# EAGLE design untitled (EAGLE 7.3.2)
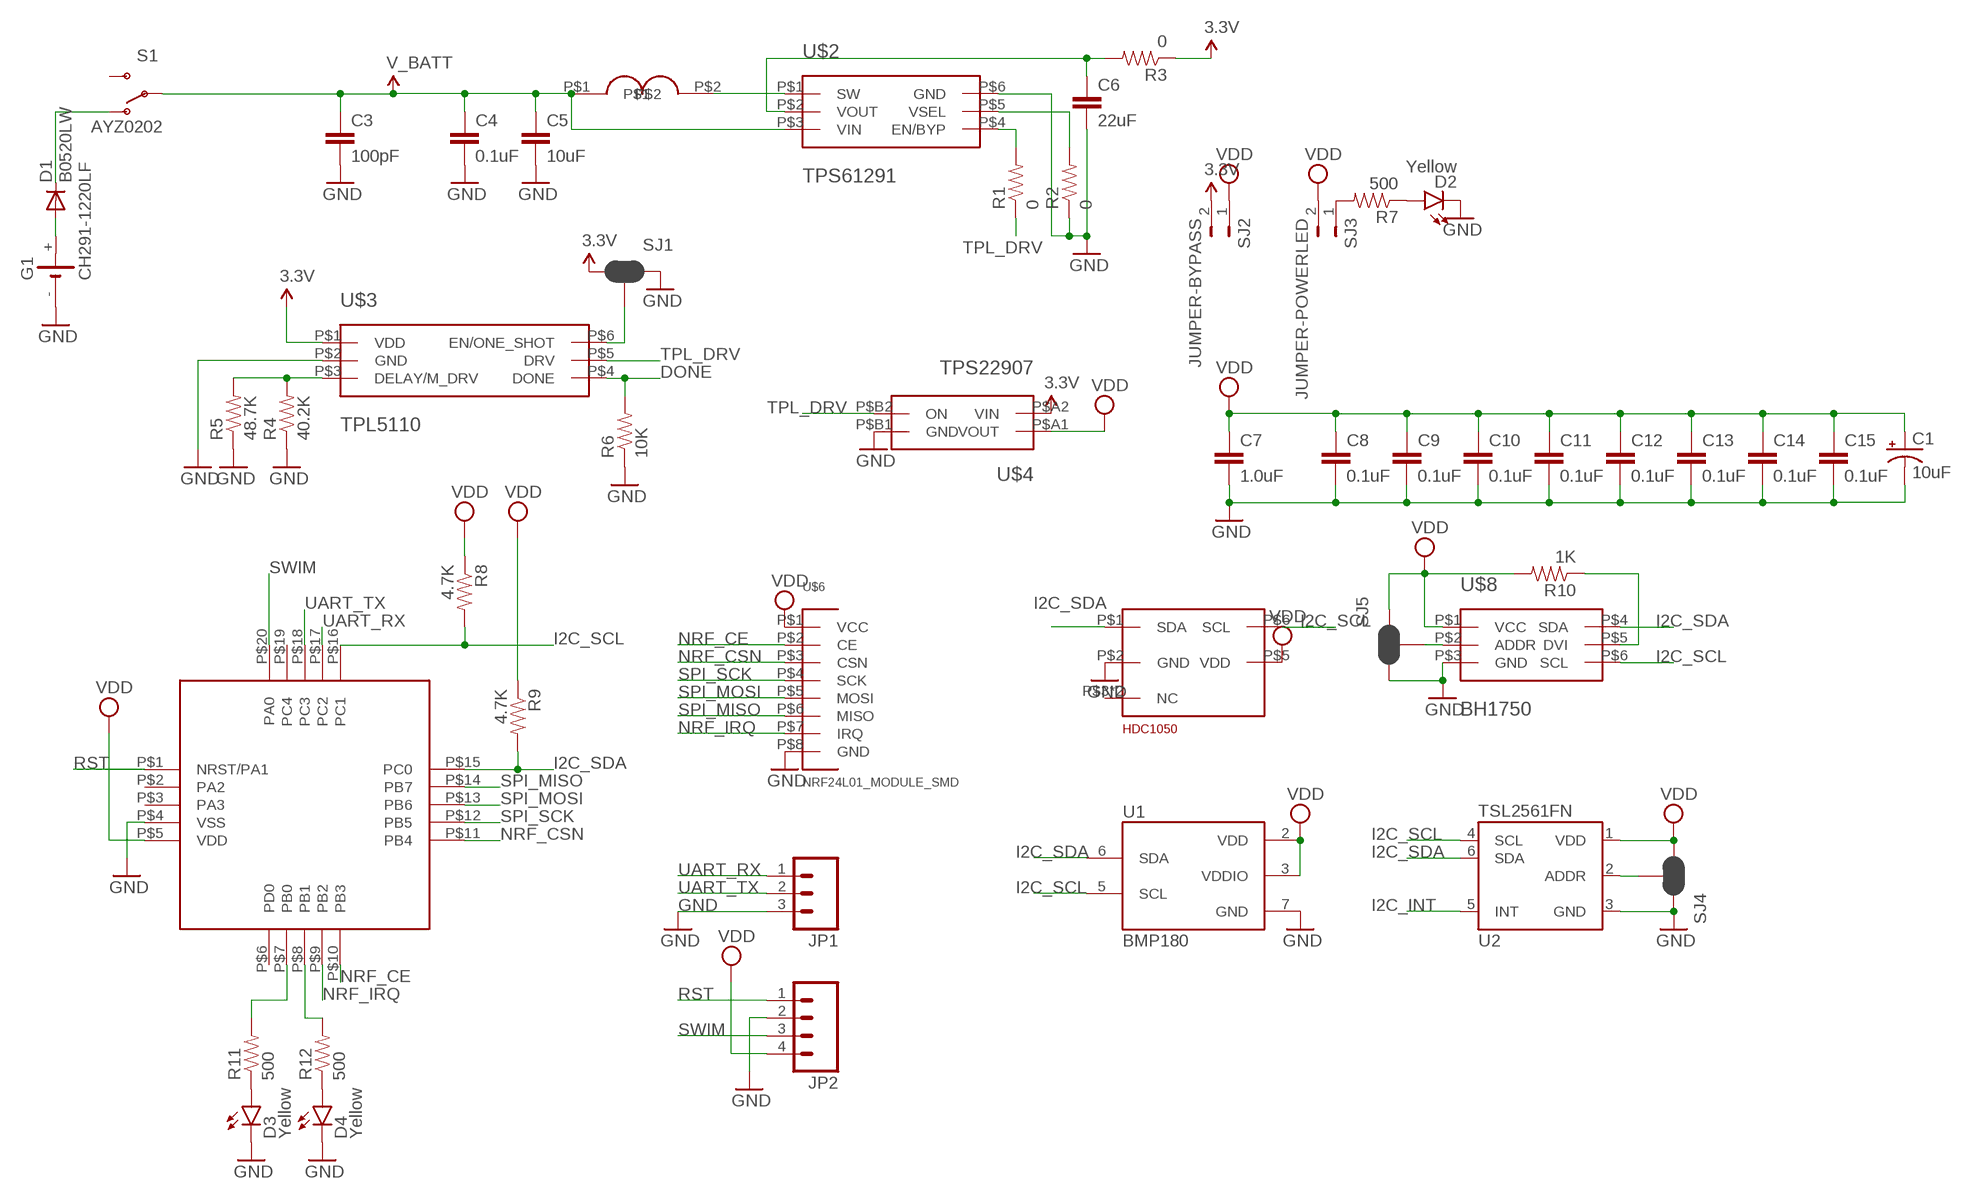
[diagram p0: schematic, sheet 1]

## Parts
C1  10uF  10UF-16V-10%(TANT)  [EIA3216]
C3  100pF  100PF-50V-5%(0603)  [0603-CAP]
C4  0.1uF  100PF-50V-5%(0603)  [0603-CAP]
C5  10uF  100PF-50V-5%(0603)  [0603-CAP]
C6  22uF  100PF-50V-5%(0603)  [0603-CAP]
C7  1.0uF  1.0UF-16V-10%(0603)  [0603-CAP]
C8  0.1uF  0.1UF-25V-5%(0603)  [0603-CAP]
C9  0.1uF  0.1UF-25V-5%(0603)  [0603-CAP]
C10  0.1uF  0.1UF-25V-5%(0603)  [0603-CAP]
C11  0.1uF  0.1UF-25V-5%(0603)  [0603-CAP]
C12  0.1uF  0.1UF-25V-5%(0603)  [0603-CAP]
C13  0.1uF  0.1UF-25V-5%(0603)  [0603-CAP]
C14  0.1uF  0.1UF-25V-5%(0603)  [0603-CAP]
C15  0.1uF  0.1UF-25V-5%(0603)  [0603-CAP]
D1  B0520LW  CGRM4001-G  [SOD-123_MINI-SMA]
D2  Yellow  LED-YELLOW0603  [LED-0603]
D3  Yellow  LED-YELLOW0603  [LED-0603]
D4  Yellow  LED-YELLOW0603  [LED-0603]
G1  CH291-1220LF  [CH291-1220LF]
JP1  M03LOCK  [1X03_LOCK]
JP2  M04LOCK  [1X04_LOCK]
R1  0  1.5KOHM-1/10W-1%(0603)  [0603]
R2  0  1.5KOHM-1/10W-1%(0603)  [0603]
R3  0  1.5KOHM-1/10W-1%(0603)  [0603]
R4  40.2K  0.22OHM-1/4W-1%(0805)  [0805]
R5  48.7K  0.22OHM-1/4W-1%(0805)  [0805]
R6  10K  1.5KOHM-1/10W-1%(0603)  [0603]
R7  500  1.5KOHM-1/10W-1%(0603)  [0603]
R8  4.7K  1.5KOHM-1/10W-1%(0603)  [0603]
R9  4.7K  1.5KOHM-1/10W-1%(0603)  [0603]
R10  1K  1.5KOHM-1/10W-1%(0603)  [0603]
R11  500  1.5KOHM-1/10W-1%(0603)  [0603]
R12  500  1.5KOHM-1/10W-1%(0603)  [0603]
S1  AYZ0202  SWITCH-SPDTSMD  [AYZ0202]
SJ1  JUMPER-PAD-3-NC_BY_PASTE  [PAD-JUMPER-3-NC_BY_PASTE_YES_SILK_FULL_BOX]
SJ2  JUMPER-BYPASS  JUMPER-PTH-2-NO  [PTH-JUMPER-2-NO_NO_SILK]
SJ3  JUMPER-POWERLED  JUMPER-PTH-2-NO  [PTH-JUMPER-2-NO_NO_SILK]
SJ4  JUMPER-PAD-3-NC_BY_PASTE  [PAD-JUMPER-3-NC_BY_PASTE_YES_SILK_FULL_BOX]
SJ5  JUMPER-PAD-3-NC_BY_PASTE  [PAD-JUMPER-3-NC_BY_PASTE_YES_SILK_FULL_BOX]
U1  BMP180  [BMP180]
U2  TSL2561FN  [FN-6]
U$1  SWPA4018S3R3MT  [SWPA4018S]
U$2  TPS61291  [PWSON-N6]
U$3  TPL5110  [DDC(R-PDSO-G6)]
U$4  TPS22907  [YZT(S-XBGA-N4)]
U$5  STM8L101  [UFQFPN20]
U$6  NRF24L01_MODULE_SMD  [M08-1.27]
U$7  HDC1050  [PWSON-N6]
U$8  BH1750  [WSOF-6]

## Nets
3.3V: R3.1 SJ1.1 SJ2.2 U$3.P$1(VDD) U$4.P$A2(VIN)
DONE: R6.2 U$3.P$4(DONE)
GND: C1.C(-) C3.2 C4.2 C5.2 C6.2 C7.2 C8.2 C9.2 C10.2 C11.2 C12.2 C13.2 C14.2 C15.2 D2.C D3.C D4.C G1.- JP1.3 JP2.2 R2.1 R4.1 R5.1 R6.1 SJ1.3 SJ4.3 SJ5.1 U1.7(GND) U2.3(GND) U$2.P$6(GND) U$3.P$2(GND) U$4.P$B1(GND) U$5.P$4(VSS) U$6.P$8(GND) U$7.P$2(GND) U$8.P$3(GND)
I2C_INT: U2.5(INT)
I2C_SCL: R8.2 U1.5(SCL) U2.4(SCL) U$5.P$16(PC1) U$7.P$6(SCL) U$8.P$6(SCL)
I2C_SDA: R9.2 U1.6(SDA) U2.6(SDA) U$5.P$15(PC0) U$7.P$1(SDA) U$8.P$4(SDA)
MESH: C1.A(+) C7.1 C8.1 C9.1 C10.1 C11.1 C12.1 C13.1 C14.1 C15.1 JP2.4 R8.1 R9.1 R10.2 SJ2.1 SJ3.2 SJ4.1 SJ5.3 U1.2(VDD) U1.3(VDDIO) U2.1(VDD) U$4.P$A1(VOUT) U$5.P$5(VDD) U$6.P$1(VCC) U$7.P$5(VDD) U$8.P$1(VCC) ; supply symbol labelled VDD
N$1: D1.A G1.+
N$2: D1.C S1.1(O)
N$3: U$1.P$2 U$2.P$1(SW)
N$4: C6.1 R3.2 U$2.P$2(VOUT)
N$5: R1.2 U$2.P$4(EN/BYP)
N$6: R2.2 U$2.P$5(VSEL)
N$7: R4.2 R5.2 U$3.P$3(DELAY/M_DRV)
N$8: R7.2 SJ3.1
N$9: D2.A R7.1
N$10: SJ1.2 U$3.P$6(EN/ONE_SHOT)
N$11: SJ4.2 U2.2(ADDR)
N$12: SJ5.2 U$8.P$2(ADDR)
N$13: R10.1 U$8.P$5(DVI)
N$14: D3.A R11.1
N$15: D4.A R12.1
N$16: R11.2 U$5.P$7(PB0)
N$17: R12.2 U$5.P$8(PB1)
NRF_CE: U$5.P$10(PB3) U$6.P$2(CE)
NRF_CSN: U$5.P$11(PB4) U$6.P$3(CSN)
NRF_IRQ: U$5.P$9(PB2) U$6.P$7(IRQ)
RST: JP2.1 U$5.P$1(NRST/PA1)
SPI_MISO: U$5.P$14(PB7) U$6.P$6(MISO)
SPI_MOSI: U$5.P$13(PB6) U$6.P$5(MOSI)
SPI_SCK: U$5.P$12(PB5) U$6.P$4(SCK)
SWIM: JP2.3 U$5.P$20(PA0)
TPL_DRV: R1.1 U$3.P$5(DRV) U$4.P$B2(ON)
UART_RX: JP1.1 U$5.P$17(PC2)
UART_TX: JP1.2 U$5.P$18(PC3)
V_BATT: C3.1 C4.1 C5.1 S1.2(P) U$1.P$1 U$2.P$3(VIN)
Unconnected: S1.3(S) U$5.P$2(PA2) U$5.P$3(PA3) U$5.P$6(PD0) U$5.P$19(PC4) U$7.P$3(NC) U$7.P$4(NC)

## Library data of the parts
C1 = SparkFun-Capacitors:10UF-16V-10%(TANT): CAP-00811 1206/EIA-3216 Tantalum capacitor; PROD_ID: CAP-00811
C3 = SparkFun-Capacitors:100PF-50V-5%(0603): CAP-07883; PROD_ID: CAP-07883
C4-C6 = SparkFun-Capacitors:100PF-50V-5%(0603): CAP-07883; PROD_ID: CAP-07883; VALUE: 100pF
C7 = SparkFun-Capacitors:1.0UF-16V-10%(0603): CAP-00868; PROD_ID: CAP-00868
C8-C15 = SparkFun-Capacitors:0.1UF-25V-5%(0603): CAP-08604; PROD_ID: CAP-08604
D1 = diode:CGRM400*-G: Molded plasitc,JEDEC SOD-123/Mini SMA Source: Comchip CGRM4001-G.pdf
D2-D4 = SparkFun-LED:LED-YELLOW: Yellow SMD LEDs LilyPad 1206- DIO-09909 0603- DIO-09003 "SMART" means more efficient and expensive; PROD_ID: DIO-09003
G1 = battery:CH291-1220LF: Battery Holder, SMT, 12mm multicomp PART NO. CH291-1220LF Source: Data sheet <http://www.farnell.com/datasheets/1505860.pdf>
JP1 = SparkFun-Connectors:M03: Header 3 Standard 3-pin 0.1" header. Use with straight break away headers (SKU : PRT-00116), right angle break away headers (PRT-00553), swiss pins (PRT-00743), machine pins (PRT-00117), and female headers (PRT-00115). Molex polarized connector foot print use with SKU : PRT-08232 with associated crimp pins and housings.
JP2 = SparkFun-Connectors:M04: Header 4 Standard 4-pin 0.1" header. Use with straight break away headers (SKU : PRT-00116), right angle break away headers (PRT-00553), swiss pins (PRT-00743), machine pins (PRT-00117), and female headers (PRT-00115). Molex polarized connector foot print use with SKU : PRT-08231 with associated crimp pins and housings. 1MM SMD Version SKU: PRT-10208
R1-R3 R6-R12 = SparkFun-Resistors:1.5KOHM-1/10W-1%(0603): RES-08306; PROD_ID: RES-08306; VALUE: 1.5KOHM
R4 R5 = SparkFun-Resistors:0.22OHM-1/4W-1%(0805): RES-09883; PROD_ID: RES-09883; VALUE: 0.22
S1 = SparkFun-Electromechanical:SWITCH-SPDT: SPDT Switch Simple slide switch, Spark Fun Electronics SKU : COM-00102 DPDT SMT slide switch, AYZ0202, SWCH-08179; PROD_ID: SWCH-08179; SF_ID: COM-00597
SJ1 SJ4 SJ5 = SparkFun-Passives:JUMPER-PAD-3-NC_BY_PASTE
SJ2 SJ3 = SparkFun-Passives:JUMPER-PTH-2-NO
U1 = SparkFun-Sensors:BMP180: BOSCH BMP180 DIGITAL BAROMETRIC PRESSURE SENSOR Web page: http://www.bosch-sensortec.com/en/homepage/products_3/environmental_sensors_1/bmp180_1/bmp180 Datasheet: http://ae-bst.resource.bosch.com/media/products/dokumente/bmp180/BST-BMP180-DS000-09.pdf The BMP180 is the function compatible successor of the BMP085, a new generation of high precision digital pressure sensors for consumer applications. The ultra-low power, low voltage electronics of the BMP180 is optimized for use in mobile phones, PDAs, GPS navigation devices and outdoor equipment. With a low altitude noise of merely 0.25m at fast conversion time, the BMP180 offers superior performance. The I2C interface allows for easy system integration with a microcontroller. The BMP180 is based on piezo-resistive technology for EMC robustness, high accuracy and linearity as well as long term stability. Key features: - Temperature measurement included - I2C interface - Fully calibrated - Pb-free, halogen-free and RoHS compliant, - MSL 1 Basic specs: Pressure range: 300 to 1100hPa (+9000m to -500m relating to sea level) Supply voltage: 1.8 to 3.6V (VDD), 1.62V to 3.6V (VDDIO) Package: LGA package with metal lid Small footprint: 3.6mm x 3.8mm Super-flat: 0.93mm height Low power: 5μA at 1 sample / sec. in standard mode Low noise: 0.06hPa (0.5m) in ultra low power mode, 0.02hPa (0.17m) advanced resolution mode Typical applications: - Enhancement of GPS navigation (dead-reckoning, slope detection, etc.) - In- and out-door navigation - Leisure and sports - Weather forecast - Vertical velocity indication (rise/sink speed)
U2 = SparkFun-Sensors:TSL2561: TSL2561 illumination sensor Approximates Human Eye Response Precisely Measures Illuminance Programmable Interrupt Function with User-Defined Upper and Lower Threshold 400 KHz I2C interface Programmable Analog Gain and Integration Time Supporting 1,000,000-to-1 Dynamic Range Automatically Rejects 50/60-Hz Lighting Ripple Low Active Power (0.75 mW Typical) with Power Down Mode RoHS Compliant The TSL2561 is a light-to-digital converter that transform light intensity to a digital signal output via I2C interface. The device combines one broadband photodiode (visible plus infrared) and one infrared-responding photodiode on a single CMOS integrated circuit capable of providing a near-photopic response over an effective 20-bit dynamic range (16-bit resolution). Two integrating ADCs convert the photodiode currents to a digital output that represents the irradiance measured on each channel. This digital output can be input to a microprocessor where illuminance (ambient light level) in lux is derived using an empirical formula to approximate the human eye response. The TSL2561 device supports a traditional level style interrupt that remains asserted until the firmware clears it.
U$1 = User-Submitted:SWPA4018S3R3MT
U$2 = User-Submitted:TPS61291
U$3 = User-Submitted:TPL5110
U$4 = User-Submitted:TPS22907
U$5 = st-microelectronics:STM8L101; DEVICE: STM8F101
U$6 = User-Submitted:NRF24L01_MODULE_SMD
U$7 = User-Submitted:HDC1050
U$8 = User-Submitted:BH1750

## Board
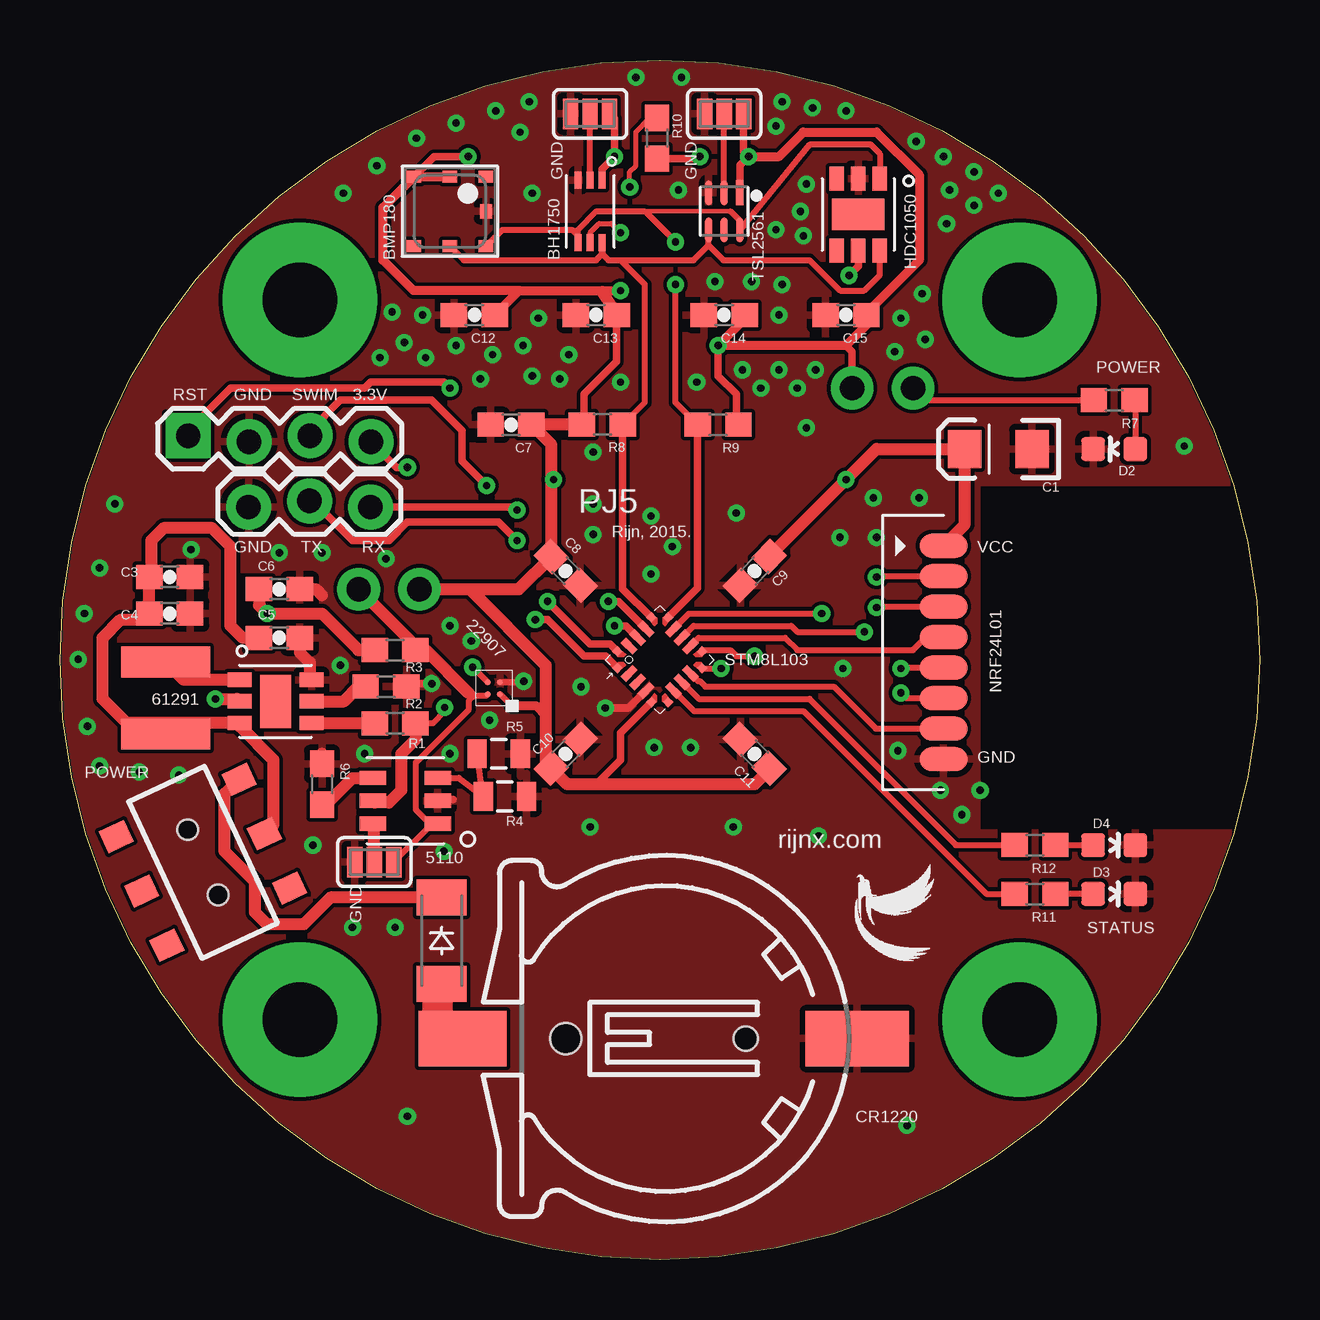
[diagram p1: board, top side]
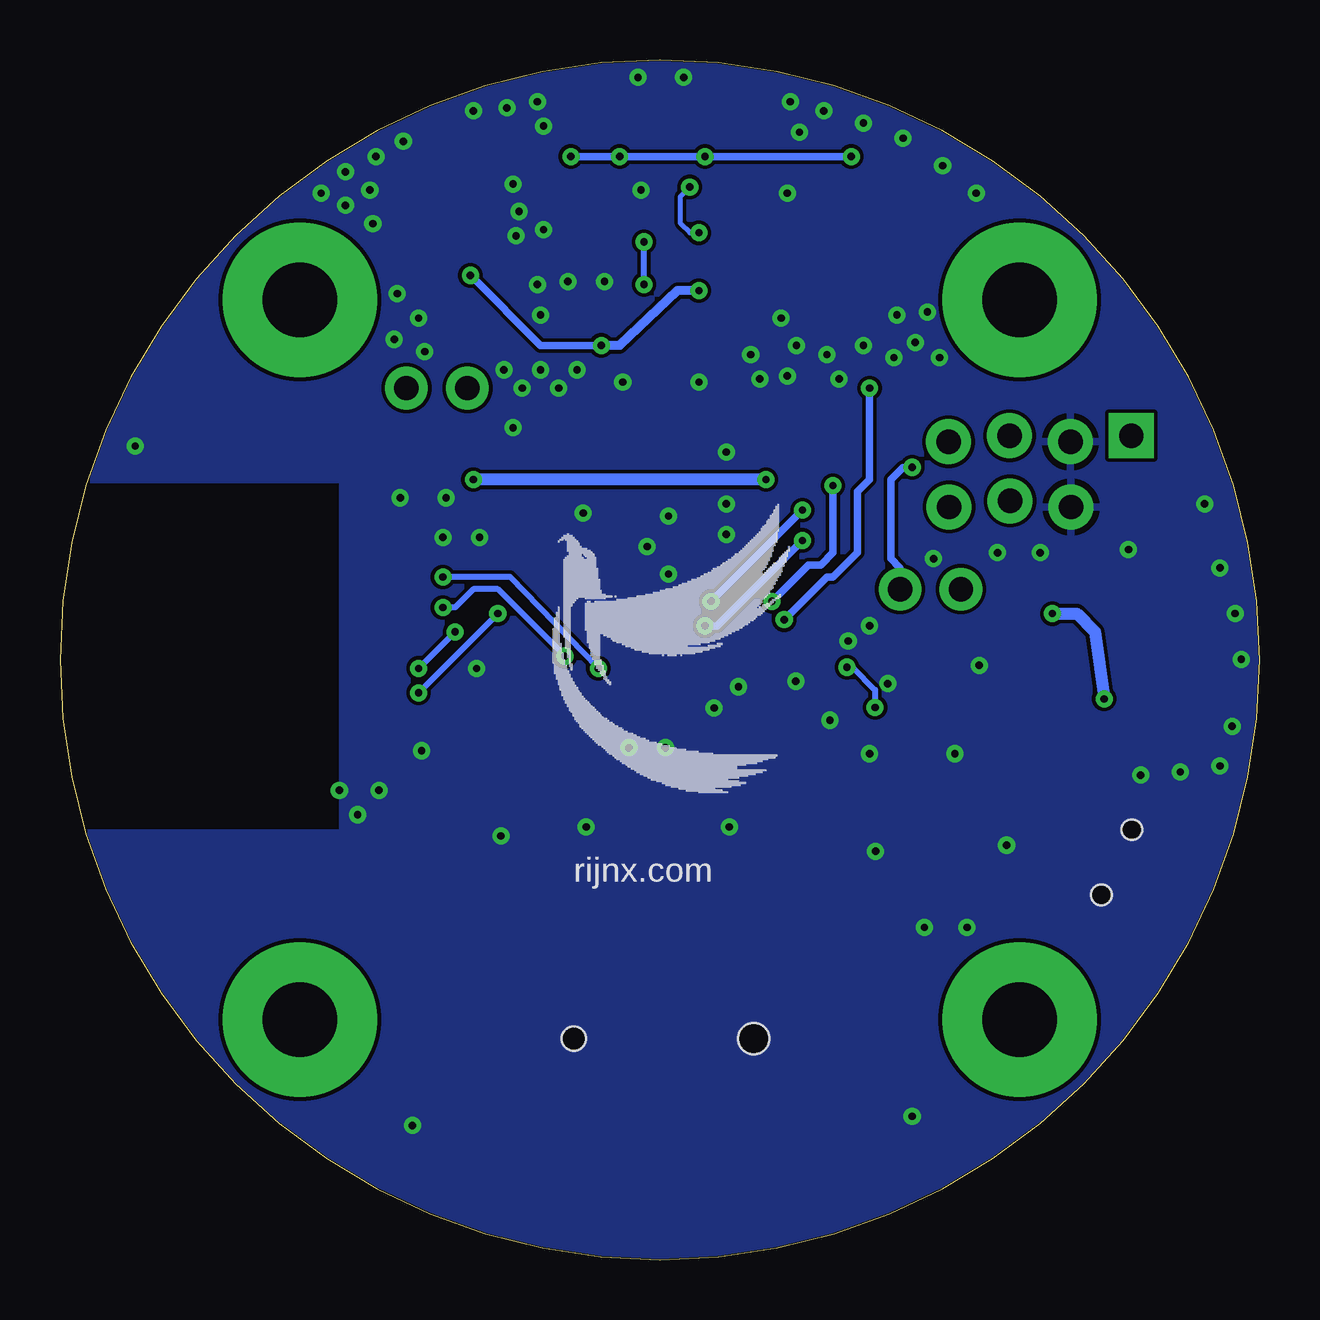
[diagram p2: board, bottom side, seen from below]

Size 50 x 50 mm. Coordinates in mm from the lower left corner, seen from the top.
Outline: 25,50 arc-180 25,0 arc-180 25,50
Copper layers (1*16): Top 0.035mm / dielectric 1.5mm / Bottom 0.035mm
Design rules "default *": minimum track width 6mil, minimum drill 12mil, track to track 6mil, track to pad 6mil, pad to pad 6mil, via to via 6mil, smd to smd 6mil, copper to edge 2mil, drill to drill 6mil, minimum pad ring 10mil, minimum via ring 8mil, stop-mask expansion 4mil, vias tented up to drill 15mil, thermal gap 10mil

### Footprints (pad centres in the part's own frame; a part is rotated, then mirrored left to right if it is on the bottom)
EIA3216 = smd 1.4 x 1.6: A 1.4,0; C -1.4,0
0603-CAP = smd 1.1 x 1: 1 -0.85,0; 2 0.85,0
SOD-123_MINI-SMA = smd 1.5 x 2.1: A 1.8,0; C -1.8,0
LED-0603 = smd 1 x 1: A 0,-0.877; C 0,0.877
CH291-1220LF = smd 2.3 x 3.66: + 0,-2.296 | smd 2.3 x 4.3: - 0,14.146 | hole 1.3: 0,2 | hole 1: 0,9.5
1X03_LOCK = drill 1.016 pad 1.88: 1 0,0.127; 2 2.54,-0.127; 3 5.08,0.127
1X04_LOCK = drill 1.016 pad 1.88 square: 1 0,0.127 | drill 1.016 pad 1.88: 2 2.54,-0.127; 3 5.08,0.127; 4 7.62,-0.127
0603 = smd 1.1 x 1: 1 -0.85,0; 2 0.85,0
0805 = smd 0.8 x 1.2: 1 -0.9,0; 2 0.9,0
AYZ0202 = smd 1 x 1.15: 1 -2.5,2.825; 2 0,2.825; 3 2.5,2.825; 4 -2.5,-2.825; 5 0,-2.825; 6 2.5,-2.825 | hole 0.85: 1.5,0; -1.5,0
PAD-JUMPER-3-NC_BY_PASTE_YES_SILK_FULL_BOX = smd 0.635 x 1.27: 1 -0.813,0; 2 0,0; 3 0.813,0
PTH-JUMPER-2-NO_NO_SILK = drill 1.016 pad 1.778: 1 -1.27,0; 2 1.27,0
BMP180 = smd 0.6 x 0.5: 1 1.5,1.45; 2 0,1.45; 3 -1.5,1.45; 4 -1.5,-1.45; 5 0,-1.45; 6 1.5,-1.45 | smd 0.5 x 0.6: 7 1.5,0
FN-6 = smd 1.05 x 0.3: 1 -0.775,0.65; 2 -0.775,0; 3 -0.775,-0.65; 4 0.775,-0.65; 5 0.775,0; 6 0.775,0.65
SWPA4018S = smd 1.3 x 3.7: P$1 -1.5,0; P$2 1.5,0
PWSON-N6 = smd 0.6 x 1: P$1 0.9,1.5; P$2 0,1.5; P$3 -0.9,1.5; P$4 -0.9,-1.5; P$5 0,-1.5; P$6 0.9,-1.5 | smd 2.2 x 1.3: P$7 0,0
DDC(R-PDSO-G6) = smd 0.6 x 1.1: P$1 -0.95,-1.35; P$2 0,-1.35; P$3 0.95,-1.35; P$4 0.95,1.35; P$5 0,1.35; P$6 -0.95,1.35
YZT(S-XBGA-N4) = smd 0.25 x 0.25: P$A1 0.25,-0.25; P$A2 -0.25,-0.25; P$B1 0.25,0.25; P$B2 -0.25,0.25
UFQFPN20 = smd 0.3 x 0.3: P$1 -1.5,1; P$5 -1.5,-1; P$6 -1,-1.5; P$10 1,-1.5; P$11 1.5,-1; P$15 1.5,1; P$16 1,1.5; P$20 -1,1.5 | smd 0.7 x 0.3: P$2 -1.3,0.5; P$3 -1.3,0; P$4 -1.3,-0.5; P$12 1.3,-0.5; P$13 1.3,0; P$14 1.3,0.5 | smd 0.3 x 0.7: P$7 -0.5,-1.3; P$8 0,-1.3; P$9 0.5,-1.3; P$17 0.5,1.3; P$18 0,1.3; P$19 -0.5,1.3
M08-1.27 = smd 1 x 2: P$1 0,0; P$2 1.27,0; P$3 2.54,0; P$4 3.81,0; P$5 5.08,0; P$6 6.35,0; P$7 7.62,0; P$8 8.89,0
WSOF-6 = smd 0.3 x 0.7: P$1 -0.5,-1.3; P$2 0,-1.3; P$3 0.5,-1.3; P$4 0.5,1.3; P$5 0,1.3; P$6 -0.5,1.3

### Placement (x,y rotation side)
C1  39.12,33.78 180 top
C3  4.57,28.45 0 top
C4  4.57,26.92 0 top
C5  9.14,25.91 0 top
C6  9.14,27.94 0 top
C7  18.8,34.8 180 top
C8  21.08,28.7 315 top
C9  28.96,28.7 225 top
C10  21.08,21.08 45 top
C11  28.96,21.08 135 top
C12  17.27,39.37 180 top
C13  22.35,39.37 180 top
C14  27.69,39.37 180 top
C15  32.77,39.37 180 top
D1  15.91,13.29 270 top
D2  43.94,33.78 90 top
D3  43.94,15.24 270 top
D4  43.94,17.27 270 top
G1  19.08,9.21 270 top
JP1  12.94,31.49 180 top
JP2  5.34,34.21 0 top
R1  13.97,22.35 180 top
R2  13.59,23.88 180 top
R3  13.97,25.4 180 top
R4  18.54,19.3 180 top
R5  18.29,21.08 180 top
R6  10.92,19.81 270 top
R7  43.94,35.81 180 top
R8  22.61,34.8 0 top
R9  27.43,34.8 180 top
R10  24.89,46.74 270 top
R11  40.64,15.24 180 top
R12  40.64,17.27 180 top
S1  5.96,16.56 295 top
SJ1  13.1,16.57 180 top
SJ2  13.72,27.94 180 top
SJ3  34.29,36.32 180 top
SJ4  27.69,47.75 180 top
SJ5  22.1,47.75 0 top
U1  16.26,43.69 0 top
U2  27.69,43.69 270 top
U$1  4.41,23.41 90 top
U$2  8.98,23.27 90 top
U$3  14.4,19.12 90 top
U$4  18.09,23.81 0 top
U$5  25,25 45 top
U$6  36.83,29.75 270 top
U$7  33.27,43.56 0 top
U$8  22.1,43.69 180 top
U$9  [LOGO-3]  29.51,19.41 0 bottom
U$10  [LOGO-1]  33.12,12.43 0 top

### Tracks (layer width: path | path; a pad name or v marks a point on that pad's centre or on a via)
3.3V
  Top 0.254: 17.02,23.62 17.17,23.62 17.27,23.52 | 17.27,23.52 17.8,23.52 U$4.P$A2 | U$3.P$1 15.4,18.17 | 15.4,18.17 14.83,18.75 14.83,20.73 17.04,22.94 17.04,23.29 17.27,23.52 | 15.4,18.17 15.4,18.06 SJ1.1
  Top 0.508: SJ2.2 14.82,25.57 R3.1 15.24,25.4 17.02,23.62
DONE
  Top 0.508: R6.2 11.09,18.96 12.19,20.07 U$3.P$4
GND  (via drill 0.3)
  Top 0.254: U$4.P$B1 19.29,24.06 v19.33,24.11
  Top 0.305: R2.1 14.95,24 v15.49,24 | U$3.P$2 15.8,19.18 16.38,19.18 | U$5.P$4 23.69,22.99 v22.73,22.99
  Top 0.508: C5.2 9.99,25.31 10.41,24.89 10.41,24.24 U$2.P$6 | C6.2 10.67,27.94 10.92,27.69 | R6.1 10.92,21.08
  other vias: 11.68,24.77 21.21,37.72 19.68,36.83 18.03,37.72 14.35,38.23 11.81,44.45 19.68,44.45 30.1,48.26 30.1,40.64 25.78,44.58 16.26,26.42 17.14,25.78 22.23,31.5 22.23,30.23 22.23,33.66 2.29,31.5 5.46,29.59 17.91,22.48 21.72,23.88 24.77,21.34 26.29,21.34 31.62,17.65 14.48,5.97 35.31,5.59 28.19,31.11 24.64,30.99 25.53,29.72 24.64,28.57 22.1,18.03 28.07,18.03 32.51,30.1 32.64,24.64 34.92,21.21 34.04,30.1 33.91,31.75 35.81,31.75 46.86,33.91 36.7,19.56 38.35,19.56 37.59,18.54 1.65,28.83 1.02,26.92 0.76,25.02 1.14,22.23 1.65,20.57 3.3,20.32 4.95,20.19 10.54,17.27 9.14,29.46 10.92,29.46 13.59,29.21 12.19,13.84 13.97,13.84 16,17.02 16.26,21.08 31.11,34.67 13.21,45.59 14.86,46.74 16.51,47.37 18.16,47.88 19.56,48.26 19.18,46.99 24,49.28 25.91,49.28 31.37,48.01 32.77,47.88 29.84,47.24 35.69,46.61 36.83,45.97 38.1,45.34 39.12,44.45 37.08,44.58 38.1,43.94 36.96,43.18 35.94,40.26 35.05,39.24 36.07,38.35 34.8,37.85 13.84,39.5 15.11,39.37 13.34,37.59 15.24,37.59 16.51,38.1 17.53,36.7 19.94,39.24 19.3,38.1 20.83,36.7 23.37,36.58 26.54,36.58 28.45,37.08 29.21,36.32 29.97,37.08 30.73,36.32 31.5,37.08 30.86,43.69 29.84,42.93 30.99,42.67 27.3,40.77 28.83,40.77 29.97,39.37 12.7,21.08 31.11,44.83
  pour Top: -1.27,51.31 50.8,51.31 50.8,32.38 38.23,32.38 38.23,17.78 50.93,17.78 50.93,-0.64 -1.27,-0.64
  pour Bottom: 0.13,53.72 53.09,53.72 53.09,32.51 38.23,32.51 38.23,17.78 50.93,17.78 50.93,-0.51 -0.38,-0.51 -0.38,53.72
I2C_SCL
  Top 0.254: U1.5 16.84,41.66 22.35,41.66 22.6,41.9 U$8.P$6 22.61,41.91 22.86,41.66 23.37,41.66 | 23.37,41.66 26.42,41.66 27.04,42.28 | 27.04,42.28 U2.4 | 27.04,42.28 27.66,41.66 31.24,41.66 32.51,40.39 33.53,40.39 34.17,41.03 U$7.P$6 | R8.2 24.38,35.73 24.38,40.64 23.37,41.66
  Top 0.305: U$5.P$16 23.46,27.96 R8.2
I2C_SDA  (via drill 0.3)
  Top 0.178: 27.94,43.69 23.75,43.69
  Top 0.254: U1.6 18.44,42.93 21.34,42.93 21.59,42.67 | 21.59,42.67 21.6,42.66 U$8.P$4 21.59,42.67 | 21.59,42.67 21.59,42.93 22.35,43.69 23.75,43.69 24.38,43.69 v25.65,42.42 | 27.94,43.69 28.34,43.29 U2.6 31.27,46.48 33.78,46.48 34.17,46.09 U$7.P$1 | R9.2 25.65,35.73 v25.65,40.64
  Top 0.305: U$5.P$15 26.58,28 R9.2
  Bottom 0.254: v25.65,40.64 v25.65,42.42
MESH  (via drill 0.3)
  Top 0.178: v20.57,32.51 20.48,32.6 20.48,33.53
  Top 0.254: U$4.P$A1 18.82,23.09
  Top 0.305: U$8.P$1 22.6,45.46 v23.11,45.97 23.11,47.55 SJ5.3 | v17.02,45.97 15.59,45.97 U1.3 | U2.1 28.34,45.61 v28.7,45.97 28.5,46.18 SJ4.1 | U$7.P$5 33.27,41.4 v32.89,41.02 | R10.2 26.58,45.89 v26.67,45.97 | C13.1 23.2,37.43 21.84,36.07 21.84,34.89 R8.1 | v27.43,38.1 27.43,36.83 28.19,36.07 28.19,34.89 R9.1 | SJ3.2 33.02,37.85 32.77,38.1 | U$5.P$5 23.37,21.95 23.37,20.83 22.35,19.81 | JP2.4 14.03,33.02 v14.48,33.02
  Top 0.381: 18.82,23.09 19.84,23.09 20.24,22.68 | C12.1 19.14,40.39 | 19.14,40.39 22.61,40.39 | 22.61,40.39 23.2,39.54 C13.1 22.61,40.22 22.61,40.39 | 22.61,40.39 v23.37,40.39 | C14.1 28.54,39.2 v27.43,38.1 32.77,38.1 33.62,38.95 C15.1 | 19.14,40.39 14.73,40.39 13.46,41.66 13.46,43.84 U1.3 U1.2 | v28.7,45.97 29.97,45.97 30.99,46.99 34.04,46.99 35.81,45.21 35.81,41.66 33.53,39.37
  Top 0.508: C9.1 v32.77,32.51 34.04,33.78 C1.A 37.72,30.64 U$6.P$1 | R8.1 C7.1 20.48,33.96 20.48,33.53 C8.1 19.12,27.94 SJ2.1 17.07,27.94 20.24,24.77 20.24,22.68 20.24,20.72 C10.1 21.15,19.81 22.35,19.81 28.96,19.81 29.56,20.41 C11.1
  Bottom 0.305: v17.02,45.97 v23.11,45.97 v26.67,45.97 v28.7,45.97 | v32.89,41.02 29.97,38.1 v27.43,38.1 | v14.48,33.02 14.86,33.02 15.37,32.51 15.37,29.21 14.99,28.83 SJ2.1
  Bottom 0.381: v23.37,40.39 24.26,40.39 26.67,38.1 v27.43,38.1
  Bottom 0.508: v20.57,32.51 v32.77,32.51
N$1
  Top 1.27: D1.A 15.75,11.49 15.75,9.65 16.79,9.65 G1.+
N$2
  Top 0.508: D1.C 11.28,15.09 10.16,13.97 8.64,13.97 8.13,14.48 8.13,15.75 6.86,17.02 6.86,19.41 S1.1
N$3
  Top 0.508: U$2.P$1 5.16,24.17 U$1.P$2
N$4  (via drill 0.3)
  Top 0.508: C6.1 8.29,27.27 v8.64,26.92 10.92,26.92 12.45,25.4 R3.2 | v6.48,23.37 7.38,23.37 U$2.P$2
  Bottom 0.508: v8.64,26.92 7.62,26.92 6.86,26.16 v6.48,23.37
N$5
  Top 0.508: U$2.P$4 13.11,22.37 R1.2
N$6
  Top 0.508: U$2.P$5 11.84,23.27 12.45,23.88 R2.2
N$7
  Top 0.254: U$3.P$3 16.62,20.07 R4.2 R5.2
N$8
  Top 0.254: SJ3.1 36.07,35.81 R7.2
N$9
  Top 0.254: R7.1 44.82,35.79 D2.A
N$10
  Top 0.508: SJ1.2 13.1,18.12 U$3.P$6
N$11
  Top 0.254: U2.2 SJ4.2
N$12
  Top 0.254: U$8.P$2 SJ5.2
N$13  (via drill 0.3)
  Top 0.203: U$8.P$5 22.1,42.8 22.48,43.18 22.99,43.18 v23.37,42.8 | v23.75,44.7 23.75,45.34 24,45.59 24,46.99 24.6,47.59 R10.1
  Bottom 0.203: v23.37,42.8 23.75,42.8 24.13,43.18 24.13,44.32 v23.75,44.7
N$14
  Top 0.254: D3.A R11.1
N$15
  Top 0.254: R12.1 D4.A
N$16
  Top 0.254: U$5.P$7 26.43,22.86 30.99,22.86 38.61,15.24 R11.2
N$17
  Top 0.254: U$5.P$8 26.63,23.37 31.24,23.37 37.34,17.27 R12.2
N$18  (via drill 3.1 pad 6.45)
  other vias: 40,40
N$19  (via drill 3.1 pad 6.45)
  other vias: 40,10
N$20  (via drill 3.1 pad 6.45)
  other vias: 10,10
N$21  (via drill 3.1 pad 6.45)
  other vias: 10,40
NRF_CE  (via drill 0.3)
  Top 0.254: U$5.P$10 26.78,24.64 v27.56,24.64 | v34.04,28.45 34.07,28.48 U$6.P$2
  Bottom 0.254: v27.56,24.64 31.24,28.45 v34.04,28.45
NRF_CSN  (via drill 0.3)
  Top 0.254: U$5.P$11 26.81,25.4 27.94,25.4 28.19,25.15 v28.96,25.15 | v34.04,27.18 34.07,27.21 U$6.P$3
  Bottom 0.254: v28.96,25.15 31.75,27.94 32.77,27.94 33.53,27.18 v34.04,27.18
NRF_IRQ
  Top 0.254: U$5.P$9 26.6,24.11 26.67,24.11 26.9,23.88 32.26,23.88 34,22.13 U$6.P$7
RST  (via drill 0.3)
  Top 0.305: U$5.P$1 22.73,25.15 21.84,25.15 20.32,26.67 v19.81,26.67 | v16.26,36.32 16,36.58 12.95,36.58 12.7,36.32 7.11,36.32 5.34,34.55 JP2.1
  Bottom 0.305: v19.81,26.67 18.03,28.45 17.78,28.45 16.76,29.46 16.76,32 16.26,32.51 v16.26,36.32
SPI_MISO  (via drill 0.3)
  Top 0.254: U$5.P$14 26.22,26.92 v31.75,26.92 | v35.05,23.62 35.27,23.4 U$6.P$6
  Bottom 0.254: v31.75,26.92 v35.05,23.62
SPI_MOSI  (via drill 0.3)
  Top 0.254: U$5.P$13 26.42,26.42 30.48,26.42 30.73,26.16 v33.53,26.16 | v35.05,24.64 35.08,24.67 U$6.P$5
  Bottom 0.254: v33.53,26.16 v35.05,24.64
SPI_SCK
  Top 0.254: U$5.P$12 26.61,25.91 30.23,25.91 30.73,25.4 35.56,25.4 36.1,25.94 U$6.P$4
SWIM  (via drill 0.3)
  Top 0.305: U$5.P$20 22.93,25.65 22.1,25.65 v20.32,27.43 | v17.78,32.26 16.76,33.27 16.76,34.54 15.49,35.81 11.68,35.81 10.42,34.55 JP2.3
  Bottom 0.305: v20.32,27.43 18.8,28.96 18.29,28.96 17.78,29.46 v17.78,32.26
TPL_DRV  (via drill 0.3)
  Top 0.254: U$4.P$B2 17.82,24.06 v17.2,24.69 | v16.03,23.01 16.03,22.84 15.54,22.35 R1.1
  Top 0.508: R1.1 14.82,21.68 14.22,21.08 14.22,19.56 13.72,19.05 13.12,19.05 U$3.P$5
  Bottom 0.254: v17.2,24.69 16.97,24.69 16.03,23.75 v16.03,23.01
UART_RX  (via drill 0.3)
  Top 0.305: U$5.P$17 23.27,27.43 v22.86,27.43 | v19.05,31.24 18.93,31.37 JP1.1
  Bottom 0.305: v22.86,27.43 v19.05,31.24
UART_TX  (via drill 0.3)
  Top 0.305: U$5.P$18 23.58,26.42 v23.11,26.42 | v19.05,29.97 18.29,30.73 14.48,30.73 13.72,29.97 12.19,29.97 10.54,31.62 JP1.2
  Bottom 0.305: v23.11,26.42 22.61,26.42 v19.05,29.97
V_BATT
  Top 0.508: U$2.P$3 4.87,22.37 U$1.P$1 | U$2.P$3 7.48,22.23 8.89,20.83 8.89,18.12 S1.2 | U$2.P$3 2.78,22.37 1.78,23.37 1.78,25.91 2.54,26.67 3.47,26.67 C4.1 C3.1 3.81,28.54 3.81,29.97 4.32,30.48 6.35,30.48 7.11,29.72 7.11,26.42 7.62,25.91 C5.1

### Text on the board
tNames: GND | GND | BMP180 | BH1750 | TSL2561 | HDC1050 | POWER | RST | GND | SWIM | 3.3V | PJ5 | Rijn, 2015. | GND | TX | RX | VCC | 22907 | STM8L103 | NRF24L01 | 61291 | GND | POWER | 5110 | rijnx.com | GND | STATUS | CR1220
bNames: rijnx.com